# Altium schematic sheet Interface.SchDoc
size A4; SheetNumber: 1; SheetTotal: 2
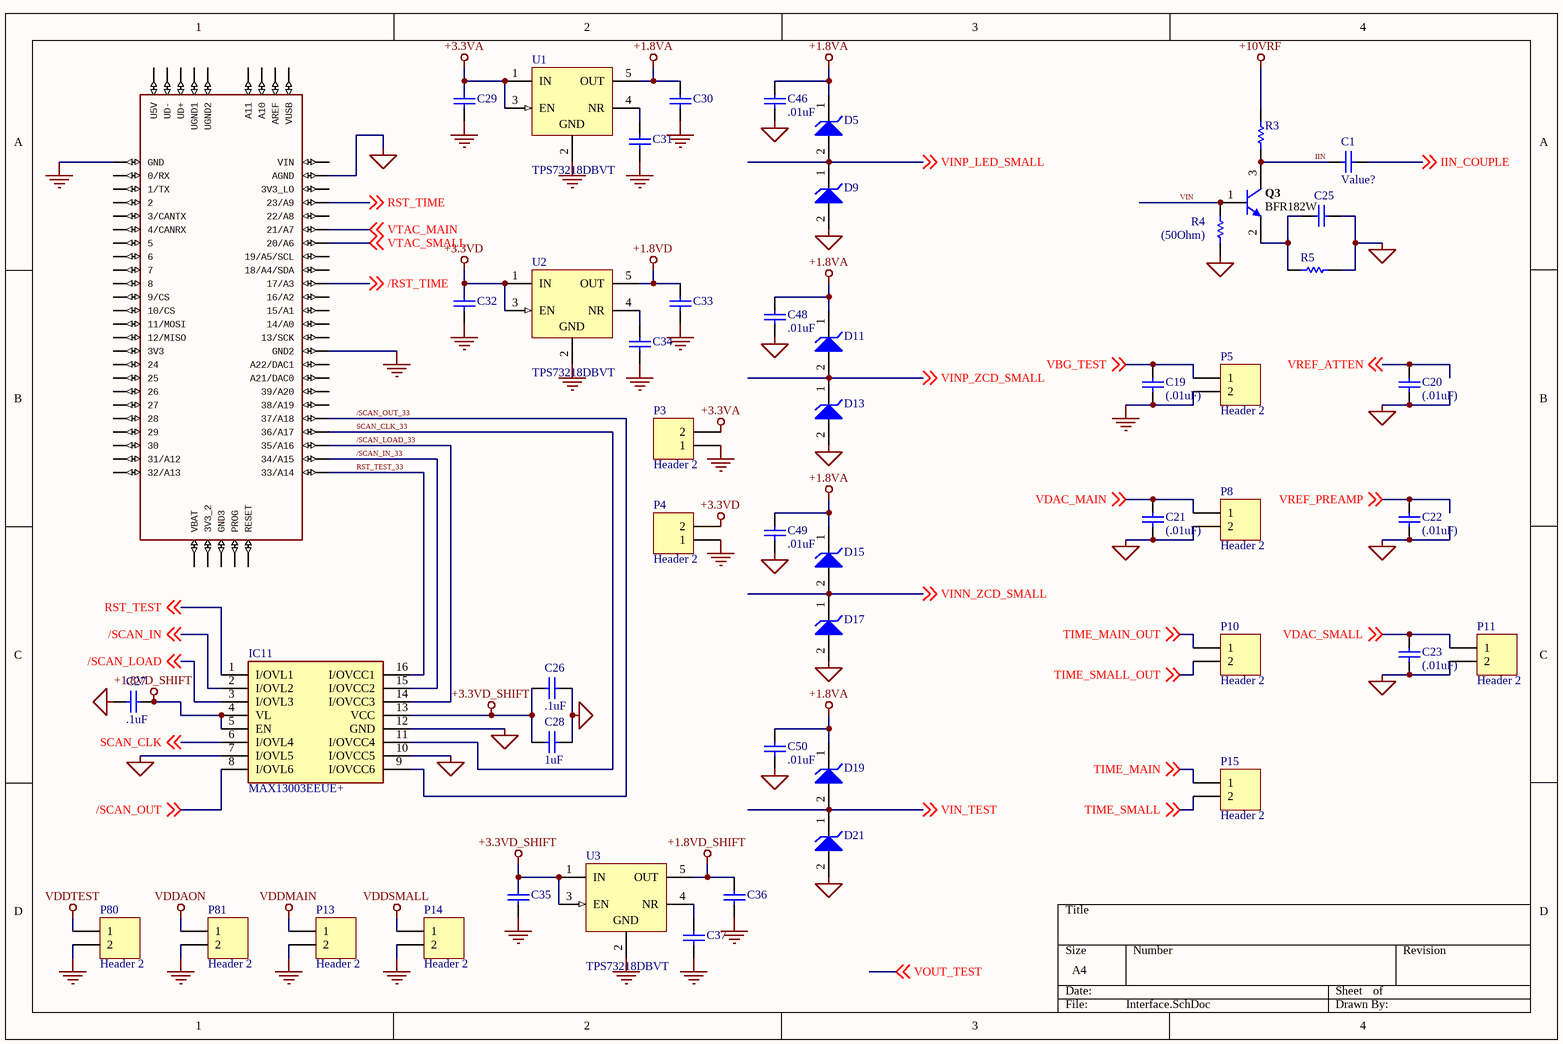
[diagram p0: Interface.SchDoc]

## Parts
1  TEENSY_3.5/3.6  [TEENSY_3.5/3.6]  (value not drawn)
C1  Value?  [CAPC2013X140X45NL15T25]
C19  (.01uF)  [CAPC2013X140X45NL15T25]
C20  (.01uF)  [CAPC2013X140X45NL15T25]
C21  (.01uF)  [CAPC2013X140X45NL15T25]
C22  (.01uF)  [CAPC2013X140X45NL15T25]
C23  (.01uF)  [CAPC2013X140X45NL15T25]
C25  (no value)  [CAPC2013X140X45NL15T25]
C26  .1uF  [CAPC2013X140X45NL15T25]
C27  .1uF  [CAPC2013X140X45NL15T25]
C28  1uF  [CAPC2013X140X45NL15T25]
C29  (no value)  [CAPC2013X140X45NL15T25]
C30  (no value)  [CAPC2013X140X45NL15T25]
C31  (no value)  [CAPC2013X140X45NL15T25]
C32  (no value)  [CAPC2013X140X45NL15T25]
C33  (no value)  [CAPC2013X140X45NL15T25]
C34  (no value)  [CAPC2013X140X45NL15T25]
C35  (no value)  [CAPC2013X140X45NL15T25]
C36  (no value)  [CAPC2013X140X45NL15T25]
C37  (no value)  [CAPC2013X140X45NL15T25]
C46  .01uF  [CAPC2013X140X45NL15T25]
C48  .01uF  [CAPC2013X140X45NL15T25]
C49  .01uF  [CAPC2013X140X45NL15T25]
C50  .01uF  [CAPC2013X140X45NL15T25]
D5  (no value)  [ONSC-SOD-123-2-425-04_V]
D9  (no value)  [ONSC-SOD-123-2-425-04_V]
D11  (no value)  [ONSC-SOD-123-2-425-04_V]
D13  (no value)  [ONSC-SOD-123-2-425-04_V]
D15  (no value)  [ONSC-SOD-123-2-425-04_V]
D17  (no value)  [ONSC-SOD-123-2-425-04_V]
D19  (no value)  [ONSC-SOD-123-2-425-04_V]
D21  (no value)  [ONSC-SOD-123-2-425-04_V]
IC11  MAX13003EEUE+  [SOP65P640X110-16N]
P3  Header 2  [HDR1X2]
P4  Header 2  [HDR1X2]
P5  Header 2  [HDR1X2]
P8  Header 2  [HDR1X2]
P10  Header 2  [HDR1X2]
P11  Header 2  [HDR1X2]
P13  Header 2  [HDR1X2]
P14  Header 2  [HDR1X2]
P15  Header 2  [HDR1X2]
P80  Header 2  [HDR1X2]
P81  Header 2  [HDR1X2]
Q3  BFR182W  [INF-SOT323_L]
R3  (no value)  [RESC1005X40X25NL05T10]
R4  (50Ohm)  [RESC1005X40X25NL05T10]
R5  (no value)  [RESC1005X40X25NL05T10]
U1  TPS73218DBVT  [DBV0005A_N]
U2  TPS73218DBVT  [DBV0005A_N]
U3  TPS73218DBVT  [DBV0005A_N]

## Nets
+1.8VA: C30.2 C46.2 C48.2 C49.2 C50.2 D5.1(K) D11.1(K) D15.1(K) D19.1(K) U1.5(OUT)
+1.8VD: C33.2 U2.5(OUT)
+1.8VD_SHIFT: C27.1 C36.2 IC11.4(VL) IC11.5(EN) U3.5(OUT)
+3.3VA: C29.2 P3.2 U1.1(IN) U1.3(EN)
+3.3VD: C32.2 P4.2 U2.1(IN) U2.3(EN)
+3.3VD_SHIFT: C26.2 C28.2 C35.2 IC11.13(VCC) U3.1(IN) U3.3(EN)
+10VRF: R3.1
GND: 1.AGND 1.GND 1.GND2 C19.1 C20.1 C21.1 C22.1 C23.1 C25.1 C26.1 C27.2 C28.1 C29.1 C30.1 C31.1 C32.1 C33.1 C34.1 C35.1 C36.1 C37.1 C46.1 C48.1 C49.1 C50.1 D9.2(A) D13.2(A) D17.2(A) D21.2(A) IC11.7(I/OVL5) IC11.10(I/OVCC5) IC11.12(GND) P3.1 P4.1 P5.2 P8.2 P11.2 P13.2 P14.2 P80.2 P81.2 R4.1 R5.1 U1.2(GND) U2.2(GND) U3.2(GND)
VDDAON: P81.1
VDDMAIN: P13.1
VDDSMALL: P14.1
VDDTEST: P80.1
/RST_TIME: 1.17/A3 ; off-sheet /RST_TIME
/SCAN_IN: IC11.2(I/OVL2) ; off-sheet /SCAN_IN
/SCAN_IN_33: 1.34/A15 IC11.15(I/OVCC2)
/SCAN_LOAD: IC11.3(I/OVL3) ; off-sheet /SCAN_LOAD
/SCAN_LOAD_33: 1.35/A16 IC11.14(I/OVCC3)
/SCAN_OUT: IC11.8(I/OVL6) ; off-sheet /SCAN_OUT
/SCAN_OUT_33: 1.37/A18 IC11.9(I/OVCC6)
IIN: C1.1 Q3.3(C) R3.2
IIN_COUPLE: C1.2 ; off-sheet IIN_COUPLE
RST_TEST: IC11.1(I/OVL1) ; off-sheet RST_TEST
RST_TEST_33: 1.33/A14 IC11.16(I/OVCC1)
RST_TIME: 1.23/A9 ; off-sheet RST_TIME
SCAN_CLK: IC11.6(I/OVL4) ; off-sheet SCAN_CLK
SCAN_CLK_33: 1.36/A17 IC11.11(I/OVCC4)
TIME_MAIN: P15.1 ; off-sheet TIME_MAIN
TIME_MAIN_OUT: P10.1 ; off-sheet TIME_MAIN_OUT
TIME_SMALL: P15.2 ; off-sheet TIME_SMALL
TIME_SMALL_OUT: P10.2 ; off-sheet TIME_SMALL_OUT
VBG_TEST: C19.2 P5.1 ; off-sheet VBG_TEST
VDAC_MAIN: C21.2 P8.1 ; off-sheet VDAC_MAIN
VDAC_SMALL: C23.2 P11.1 ; off-sheet VDAC_SMALL
VIN: Q3.1(B) R4.2
VIN_TEST: D19.2(A) D21.1(K) ; off-sheet VIN_TEST
VINN_ZCD_SMALL: D15.2(A) D17.1(K) ; off-sheet VINN_ZCD_SMALL
VINP_LED_SMALL: D5.2(A) D9.1(K) ; off-sheet VINP_LED_SMALL
VINP_ZCD_SMALL: D11.2(A) D13.1(K) ; off-sheet VINP_ZCD_SMALL
VREF_ATTEN: C20.2 ; off-sheet VREF_ATTEN
VREF_PREAMP: C22.2 ; off-sheet VREF_PREAMP
VTAC_MAIN: 1.21/A7 ; off-sheet VTAC_MAIN
VTAC_SMALL: 1.20/A6 ; off-sheet VTAC_SMALL
NetC25_2: C25.2 Q3.2(E) R5.2
NetC31_2: C31.2 U1.4(NR)
NetC34_2: C34.2 U2.4(NR)
NetC37_2: C37.2 U3.4(NR)

Not connected (* = marked no-connect by the designer): 1 0/RX 1/TX 2 3/CANTX 3V3 3V3_2 3V3_LO 4/CANRX 5 6 7 8 9/CS 10/CS 11/MOSI 12/MISO 13/SCK 14/A0 15/A1 16/A2 18/A4/SDA 19/A5/SCL 21/DAC0(A21/DAC0) 22/A8 24 25 26 27 28 29 30 31/A12 32/A13 38/A19 39/A20 A10 A11 A22/DAC1 AREF GND3 PROG RESET U5V UD+ UD- UGND1 UGND2 VBAT VIN VUSB

## Library data of the parts
1 = TEENSY_3.5/3.6: GateName_1: G$1; SymbolName_1: TEENSY_3.5/3.6; LibraryName: Teensy356; DeviceSetName: TEENSY_3.5/3.6; Package: TEENSY_3.5/3.6
C1 C19-C23 C25-C37 C46 C48-C50 = CMP-2007-03395-1: 0402; Part Number: GRM21BR71A106KE51L; Manufacturer: Murata
D5 D9 D11 D13 D15 D17 D19 D21 = CMP-1060-00509-1: Zener Voltage Regulator, 2-Pin SOD-123, Pb-Free, Tape and Reel; Manufacturer: On Semiconductor; PartNumber: MMSZ4679T1G; P Max (W): 0.5; VZ Typ (V): 2; Packing: Tape and Reel; ComponentLink1Description: Manufacturer URL; DatasheetVersion: Rev. 9; PackageReference: SOD-123-2-425-04; ComponentLink3URL: http://www.onsemi.com/pub_link/Collateral/425-04.PDF; PackageDescription: 2-Pin SOD, Body 1.6 x 2.69 mm; ComponentLink3Description: Package Specification; ComponentLink2Description: Datasheet; ComponentLink1URL: http://www.onsemi.com/; RoHS: Pb-Free; PackageVersion: Rev. G, 10/2009; ComponentLink2URL: http://www.onsemi.com/pub_link/Collateral/MMSZ4678T1-D.PDF; Mounting Technology: Surface Mount
IC11 = MAX13003EEUE+: Integrated Circuit; Manufacturer_Name: Maxim Integrated; Datasheet Link: https://pdfserv.maximintegrated.com/en/ds/MAX13000E-MAX13005E.pdf; Height: 1.1mm; Manufacturer_Part_Number: MAX13003EEUE+
P3-P5 P8 P10 P11 P13-P15 P80 P81 = Header 2: Header, 2-Pin; LatestRevisionDate: 17-Jul-2002; LatestRevisionNote: Re-released for DXP Platform.; Publisher: Altium Limited
Q3 = CMP-1191-00013-1: NPN Silicon RF Transistor, 12 V VCEO, 35 mA IC, 19 dB Gmax, SOT323, Green; Manufacturer: Infineon; Ptot (max): 250mW; Green: yes; Gmax (typ): 19 dB; IC (max): 35 mA; NFmin (typ): 0.9 dB; VCEO (max): 12 V; Group: For low frequencies e.g. VHF/UHF; ComponentLink1Description: Manufacturer URL; PackageReference: SOT323; DatasheetVersion: Apr-2010; PackageDescription: 3-Pin Small Outline Transistor Package, 1.25 x 2 mm Body, 0.65 mm Pitch; Mounting Technology: Surface Mount; ComponentLink2URL: http://www.infineon.com/dgdl/bfr182w.pdf?folderId=db3a30431400ef68011425b1354605c1&fileId=db3a30431400ef680114269d1e43064c&location=en.Products.RF.RF_Transistors_.Low_Noise_Si_Transistors_up_to_2_5_GHz.DATASHEET.bfr182w.pdf; ComponentLink3Description: Package Specification; PartNumber: BFR182W; Halogen-free: yes; ComponentLink1URL: http://www.infineon.com/; ComponentLink2Description: Datasheet; ComponentLink3URL: http://www.infineon.com/dgdl/SOT323-Package_Overview.pdf?folderId=db3a30431936bc4b0119533e1dcb3c92&fileId=db3a30431936bc4b011953495f283cb1
R3-R5 = CMP-2002-07472-1: 0402; Part Number: RC0402FR-071KL; Manufacturer: Yageo / Phycomp
U1-U3 = CMP-0394-00378-2: Single Output Fast Transient Response LDO, 200 mA, Fixed 1.8 V Output, 1.7 to 5.5 V Input, with Reverse Current Protection, 5-pin SOT-23 (DBV), -40 to 85 degC, Green (RoHS & no Sb/Br); Manufacturer: Texas Instruments; Iout(Max)(A): 0.25; Iq(Typ)(mA): 0.4; Accuracy(%): 1; Vout Adj(Min)(V): 1.8; Vdo(Typ)(mV): 40; SubFamily: Single Channel LDO; Vin(Min)(V): 1.7; Vin(Max)(V): 5.5; ComponentLink1URL: http://www.ti.com/; PartNumber: TPS73218DBVT; Eco-Plan: Green (RoHS & no Sb/Br); ComponentLink2Description: Datasheet; PackageVersion: 4073253-4/K; ComponentLink3URL: http://www.ti.com/litv/pdf/mpds018i; ComponentLink3Description: Package Specification; ComponentLink1Description: Manufacturer URL; Vout Adj(Max)(V): 1.8; Code_JEDEC: MO-178; ComponentLink2URL: http://www.ti.com/general/docs/lit/getliterature.tsp?genericPartNumber=TPS73218&fileType=pdf; DatasheetVersion: SBVS037O; Mounting Technology: Surface Mount; PackageReference: DBV0005A; PackageDescription: 5-Pin Plastic Small Outline, Body 1.60 Ãƒâ€” 2.90 mm, Pitch 0.95 mm; Fixed Output Options(V): 1.8